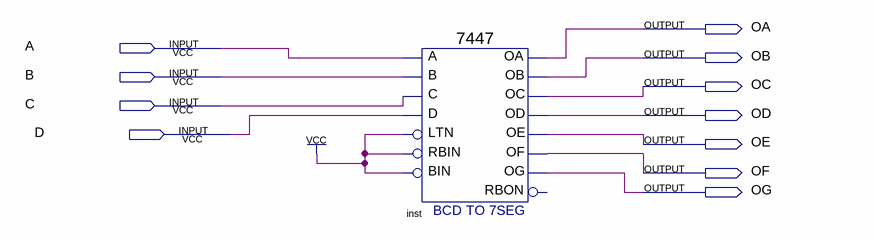
[diagram p0: schematic sheet]
// Quartus schematic 74.bdf as structural Verilog: 1 symbols, 11 pins
module \74  (
  input  A,
  input  B,
  input  C,
  input  D,
  output OA,
  output OB,
  output OC,
  output OD,
  output OE,
  output OF,
  output OG
);

  \7447  inst (
    .LTN(1'b1), .B(B), .C(C), .D(D), .RBIN(1'b1), .BIN(1'b1), .A(A), .OB(OB), .OC(OC), .OE(OE), .OD(OD),
    .OF(OF), .OG(OG), .OA(OA));  // open: RBON
endmodule
